# Altium project Encoder.PrjPcb
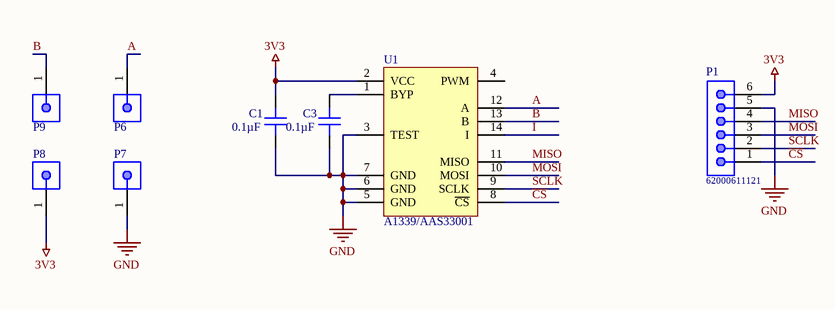
[diagram p0: Top.SchDoc]
ProjectRevision: 1.0
1 sheet, 8 parts. Net scope: global (net labels, ports and power ports of the same name join across sheets).
Board file: Encoder.PcbDoc

## Sheet Top.SchDoc
size B; DocumentNumber: 1; SheetNumber: 1; SheetTotal: 1

### Parts
C1  0.1µF  [CAP 0603_1608]
C3  0.1µF  [CAP 0603_1608]
P1  62000611121  [62000611121]
P6  61300111121  [61300111121]  (value not drawn)
P7  61300111121  [61300111121]  (value not drawn)
P8  61300111121  [61300111121]  (value not drawn)
P9  61300111121  [61300111121]  (value not drawn)
U1  A1339/AAS33001  [TSSOP14]

### Nets
3V3: C1.1 P1.6 P8.1 U1.2(VCC)
GND: C1.2 C3.2 P1.5 P7.1 U1.3(TEST) U1.5(GND) U1.6(GND) U1.7(GND)
A: P6.1 U1.12(A)
B: P9.1 U1.13(B)
~{CS}: P1.1 U1.8(~{CS})
I: U1.14(I)
MISO: P1.4 U1.11(MISO)
MOSI: P1.3 U1.10(MOSI)
SCLK: P1.2 U1.9(SCLK)
NetC3_1: C3.1 U1.1(BYP)

Not connected (* = marked no-connect by the designer): U1 4(PWM)

### Library data of the parts
C1 C3 = VJ0603V105MXQPW1BC: CAP CER 1UF 10V Y5V 0603; Manufacturer: Vishay Vitramon; Capacitance: 1µF; Temperature Coefficient: Y5V (F); Tolerance: ±20%; Part Number: VJ0603V105MXQPW1BC; Value: 0.1µF; Applications: General Purpose; ComponentLink1Description: Datasheet; ComponentLink1URL: https://www.vishay.com/docs/28548/vjw1bcbascomseries.pdf; ComponentLink2Description: DigiKey Link; ComponentLink2URL: http://digikey.com/product-detail/en/vishay-vitramon/VJ0603V105MXQPW1BC/720-1674-1-ND/8324094; Device Package: 0603 (1608 Metric); LastUpdated: 30-Aug-20 8:42:38 PM; Lifecycle Status: Active; Minimum Order: 1; Mounting Type: Surface Mount, MLCC; Operating Temperature: -25°C ~ 85°C; Package / Case: 0603 (1608 Metric); Packaging: TapeAndReel; PartId: 7087; Part Status: Active; Price: 0.04; Series: VJ; Size / Dimension: 0.063" L x 0.031" W (1.60mm x 0.80mm); Supplier 1: DigiKey; Supplier Part Number 1: 720-1674-1-ND; Thickness (Max): 0.034" (0.87mm)
P1 = 62000611121: WR-PHD Pin Header, THT, pitch 2mm, Single Row, Vertical, 6p; Manufacturer: Wurth Elektronik; Pin Number: 6; Rated Current: 2A; Working Voltage: 200VAC; Withstanding Voltage: 500VAC; Contact Resistance: 20mOhm; ComponentLink1Description: Manufacturer; ComponentLink1URL: http://www.we-online.de; ComponentLink2Description: Datasheet; ComponentLink2URL: https://www.we-online.com/catalog/datasheet/62000611121.pdf; Operating Temperature: -40 to +105degC; Published Date: May 2020; Pitch: 2mm; Manufacturer Part Number: 62000611121; Mounting Technology: THT; Packaging: Bag; Gender: Pin Header; Row Number: Single; Orientation: Vertical
P6-P9 = 61300111121: WR-PHD Pin Header, THT, pitch 2.54mm, Single Row, Vertical, 1p; Manufacturer: Wurth Elektronik; Pin Number: 1; Rated Current: 3A; Working Voltage: 250VAC; Withstanding Voltage: 500VAC; Contact Resistance: 20mOhm; ComponentLink1Description: Manufacturer; ComponentLink1URL: http://www.we-online.de; ComponentLink2Description: Datasheet; ComponentLink2URL: https://www.we-online.com/catalog/datasheet/61300111121.pdf; Manufacturer Part Number: 61300111121; Published Date: May 2020; Pitch: 2.54mm; Operating Temperature: -40 to +105degC; Mounting Technology: THT; Packaging: Bag; Gender: Pin Header; Row Number: Single; Orientation: Vertical

## Assembly variants
Main: not fitted P1 P6 P7 P8 P9